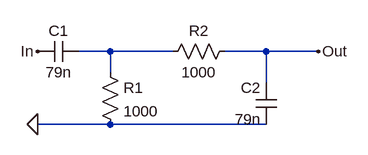
[diagram p0: schematic BpassFilter.asc]
BpassFilter.asc, the LTspice schematic file:
Version 4
SHEET 1 880 680
WIRE -128 96 -176 96
WIRE -32 96 -128 96
WIRE 112 96 48 96
WIRE 192 96 112 96
WIRE -128 128 -128 96
WIRE 112 144 112 96
WIRE -128 208 -240 208
WIRE 112 208 -128 208
FLAG -240 208 0
FLAG -240 96 In
FLAG 192 96 Out
SYMBOL cap -176 80 R90
WINDOW 0 0 32 VBottom 2
WINDOW 3 32 32 VTop 2
SYMATTR InstName C1
SYMATTR Value 79n
SYMBOL cap 128 208 R180
WINDOW 0 24 56 Left 2
WINDOW 3 24 8 Left 2
SYMATTR InstName C2
SYMATTR Value 79n
SYMBOL res -144 112 R0
SYMATTR InstName R1
SYMATTR Value 1000
SYMBOL res 64 80 R90
WINDOW 0 0 56 VBottom 2
WINDOW 3 32 56 VTop 2
SYMATTR InstName R2
SYMATTR Value 1000

The netlist it stands for:
* BpassFilter.asc
C1 N001 In 79n
C2 0 Out 79n
R1 N001 0 1000
R2 Out N001 1000
.backanno
.end